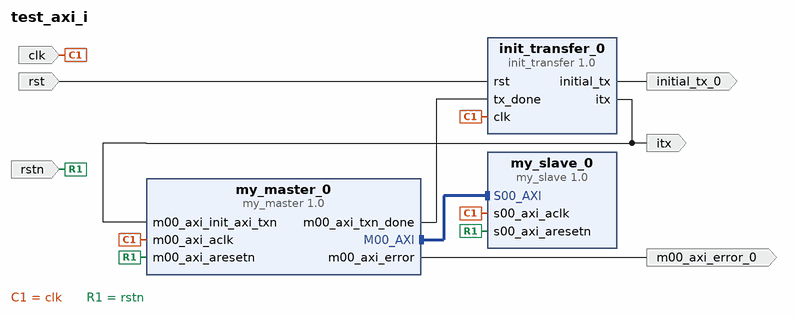
[diagram p0: block diagram of the top level]
# Vivado block design test_axi_i, xc7z010clg400-1, Vivado 2019.2
create_bd_design test_axi_i

create_bd_port -dir O initial_tx_0
create_bd_port -dir I -type clk clk
set_property -dict {CONFIG.ASSOCIATED_RESET rst:rstn} [get_bd_ports clk]
create_bd_port -dir I -type rst rst
set_property -dict {CONFIG.POLARITY ACTIVE_HIGH} [get_bd_ports rst]
create_bd_port -dir O m00_axi_error_0
create_bd_port -dir I -type rst rstn
create_bd_port -dir O itx

create_bd_cell -type ip -vlnv user.org:user:my_master:1.0 my_master_0
create_bd_cell -type ip -vlnv user.org:user:my_slave:1.0 my_slave_0
create_bd_cell -type ip -vlnv user.org:user:init_transfer:1.0 init_transfer_0

# ---- connections ----

connect_bd_intf_net [get_bd_intf_pins my_slave_0/S00_AXI] [get_bd_intf_pins my_master_0/M00_AXI]
connect_bd_net -net clk_0_1 [get_bd_ports clk] \
  [get_bd_pins my_master_0/m00_axi_aclk] [get_bd_pins my_slave_0/s00_axi_aclk] [get_bd_pins init_transfer_0/clk]
connect_bd_net [get_bd_pins my_master_0/m00_axi_error] [get_bd_ports m00_axi_error_0]
connect_bd_net [get_bd_ports rstn] [get_bd_pins my_master_0/m00_axi_aresetn] [get_bd_pins my_slave_0/s00_axi_aresetn]
connect_bd_net [get_bd_pins init_transfer_0/initial_tx] [get_bd_ports initial_tx_0]
connect_bd_net [get_bd_ports rst] [get_bd_pins init_transfer_0/rst]
connect_bd_net [get_bd_pins my_master_0/m00_axi_txn_done] [get_bd_pins init_transfer_0/tx_done]
connect_bd_net [get_bd_pins init_transfer_0/itx] [get_bd_ports itx] [get_bd_pins my_master_0/m00_axi_init_axi_txn]

# ---- address map ----
assign_bd_address -offset 0x44A00000 -range 64K -target_address_space [get_bd_addr_spaces my_master_0/M00_AXI] [get_bd_addr_segs my_slave_0/S00_AXI/S00_AXI_reg]

validate_bd_design
save_bd_design
